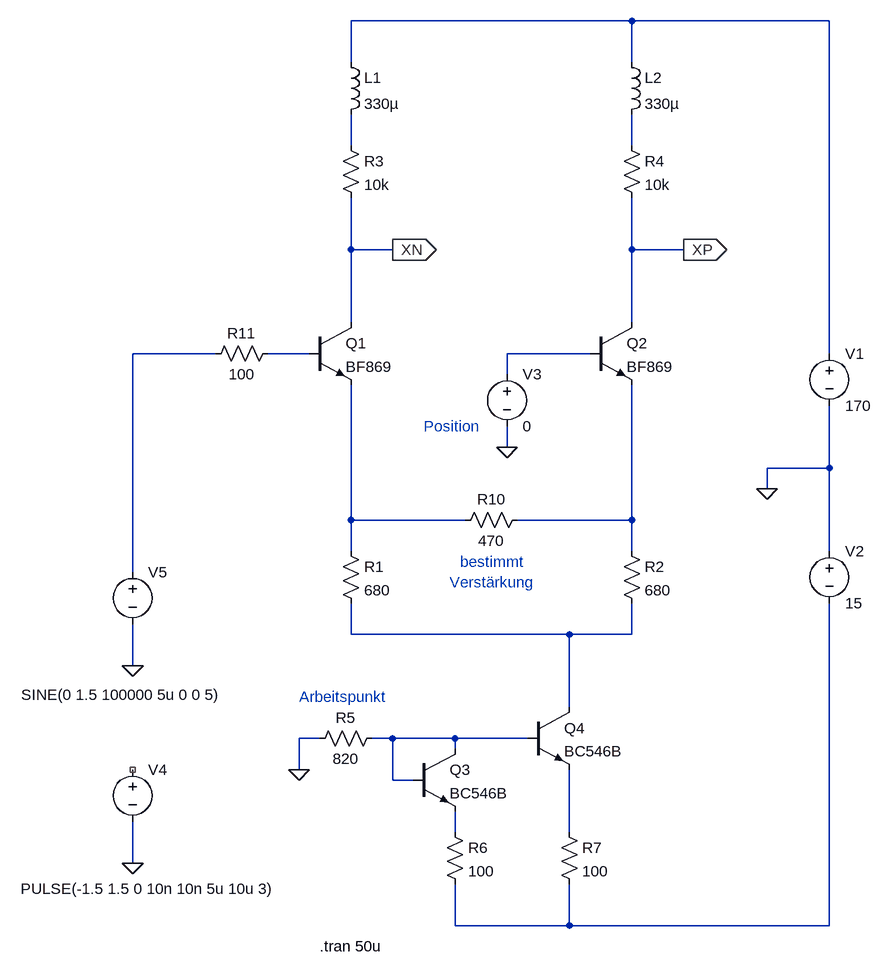
[diagram p0: schematic trans_x_defl_amp.asc]
trans_x_defl_amp.asc, the LTspice schematic file:
Version 4
SHEET 1 1400 1076
WIRE 624 -416 192 -416
WIRE 928 -416 624 -416
WIRE 192 -352 192 -416
WIRE 624 -352 624 -416
WIRE 192 -224 192 -272
WIRE 624 -224 624 -272
WIRE 192 -64 192 -144
WIRE 256 -64 192 -64
WIRE 624 -64 624 -144
WIRE 704 -64 624 -64
WIRE 192 48 192 -64
WIRE 624 48 624 -64
WIRE -16 96 -144 96
WIRE 128 96 64 96
WIRE 560 96 432 96
WIRE 928 96 928 -416
WIRE 432 128 432 96
WIRE 432 240 432 208
WIRE 928 272 928 176
WIRE 928 272 832 272
WIRE 832 304 832 272
WIRE 192 352 192 144
WIRE 368 352 192 352
WIRE 624 352 624 144
WIRE 624 352 448 352
WIRE 192 400 192 352
WIRE 624 400 624 352
WIRE 928 400 928 272
WIRE -144 432 -144 96
WIRE 192 528 192 480
WIRE 528 528 192 528
WIRE 624 528 624 480
WIRE 624 528 528 528
WIRE -144 576 -144 512
WIRE 528 640 528 528
WIRE 144 688 112 688
WIRE 256 688 224 688
WIRE 352 688 256 688
WIRE 464 688 352 688
WIRE 352 704 352 688
WIRE 112 736 112 688
WIRE 256 752 256 688
WIRE 288 752 256 752
WIRE 352 832 352 800
WIRE 528 832 528 736
WIRE -144 880 -144 816
WIRE 352 976 352 912
WIRE 528 976 528 912
WIRE 528 976 352 976
WIRE 928 976 928 480
WIRE 928 976 528 976
FLAG 832 304 0
FLAG -144 880 0
FLAG 432 240 0
FLAG -144 576 0
FLAG 704 -64 XP
IOPIN 704 -64 Out
FLAG 256 -64 XN
IOPIN 256 -64 Out
FLAG 112 736 0
SYMBOL npn 128 48 R0
SYMATTR InstName Q1
SYMATTR Value BF869
SYMBOL npn 560 48 R0
SYMATTR InstName Q2
SYMATTR Value BF869
SYMBOL res 176 -240 R0
SYMATTR InstName R3
SYMATTR Value 10k
SYMBOL res 608 -240 R0
SYMATTR InstName R4
SYMATTR Value 10k
SYMBOL voltage 928 80 R0
WINDOW 123 0 0 Left 0
WINDOW 39 0 0 Left 0
SYMATTR InstName V1
SYMATTR Value 170
SYMBOL voltage 928 384 R0
WINDOW 123 0 0 Left 0
WINDOW 39 0 0 Left 0
SYMATTR InstName V2
SYMATTR Value 15
SYMBOL voltage 432 112 R0
WINDOW 123 0 0 Left 0
WINDOW 39 0 0 Left 0
SYMATTR InstName V3
SYMATTR Value 0
SYMBOL voltage -144 720 R0
WINDOW 123 0 0 Left 0
WINDOW 39 0 0 Left 0
WINDOW 3 -172 199 Left 2
SYMATTR Value PULSE(-1.5 1.5 0 10n 10n 5u 10u 3)
SYMATTR InstName V4
SYMBOL res -32 112 R270
WINDOW 0 32 56 VTop 2
WINDOW 3 0 56 VBottom 2
SYMATTR InstName R11
SYMATTR Value 100
SYMBOL voltage -144 416 R0
WINDOW 123 0 0 Left 0
WINDOW 39 0 0 Left 0
WINDOW 3 -171 205 Left 2
SYMATTR Value SINE(0 1.5 100000 5u 0 0 5)
SYMATTR InstName V5
SYMBOL res 176 384 R0
SYMATTR InstName R1
SYMATTR Value 680
SYMBOL res 608 384 R0
SYMATTR InstName R2
SYMATTR Value 680
SYMBOL npn 288 704 R0
SYMATTR InstName Q3
SYMATTR Value BC546B
SYMBOL npn 464 640 R0
SYMATTR InstName Q4
SYMATTR Value BC546B
SYMBOL res 128 704 R270
WINDOW 0 32 56 VTop 2
WINDOW 3 0 56 VBottom 2
SYMATTR InstName R5
SYMATTR Value 820
SYMBOL res 336 816 R0
SYMATTR InstName R6
SYMATTR Value 100
SYMBOL res 512 816 R0
SYMATTR InstName R7
SYMATTR Value 100
SYMBOL res 352 368 R270
WINDOW 0 32 56 VTop 2
WINDOW 3 0 56 VBottom 2
SYMATTR InstName R10
SYMATTR Value 470
SYMBOL ind 176 -368 R0
SYMATTR InstName L1
SYMATTR Value 330µ
SYMBOL ind 608 -368 R0
SYMATTR InstName L2
SYMATTR Value 330µ
TEXT 144 1008 Left 2 !.tran 50u
TEXT 344 448 Left 2 ;Verstärkung
TEXT 360 416 Left 2 ;bestimmt
TEXT 112 624 Left 2 ;Arbeitspunkt
TEXT 304 208 Left 2 ;Position

The netlist it stands for:
* trans_x_defl_amp.asc
Q1 XN N005 N007 0 BF869
Q2 XP N006 N008 0 BF869
R3 N002 XN 10k
R4 N003 XP 10k
V1 N001 0 170
V2 0 N013 15
V3 N006 0 0
V4 NC_01 0 PULSE(-1.5 1.5 0 10n 10n 5u 10u 3)
R11 N004 N005 100
V5 N004 0 SINE(0 1.5 100000 5u 0 0 5)
R1 N007 N009 680
R2 N008 N009 680
Q3 N010 N010 N011 0 BC546B
Q4 N009 N010 N012 0 BC546B
R5 0 N010 820
R6 N011 N013 100
R7 N012 N013 100
R10 N007 N008 470
L1 N001 N002 330µ
L2 N001 N003 330µ
.model NPN NPN
.model PNP PNP
.lib standard.bjt
.tran 50u
* Verstärkung
* bestimmt
* Arbeitspunkt
* Position
.backanno
.end